# EAGLE board radio_module (EAGLE 8.3.1)
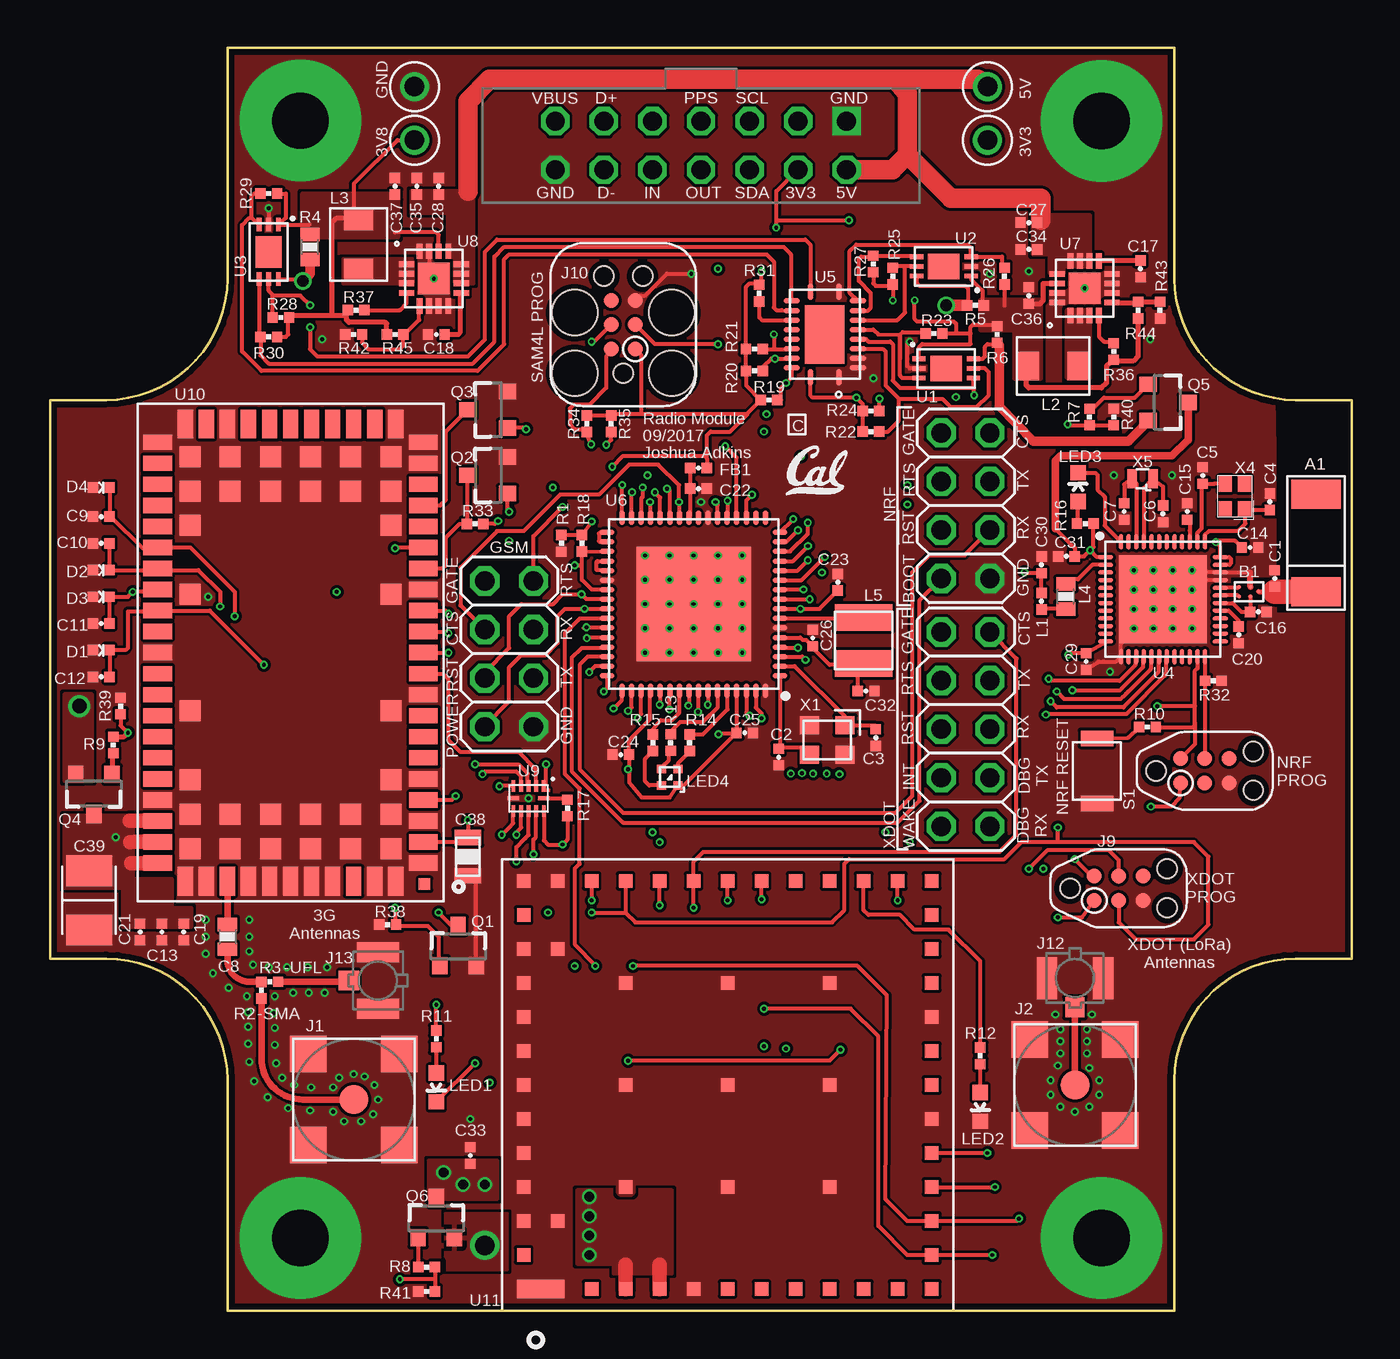
[diagram p6: board, top side]
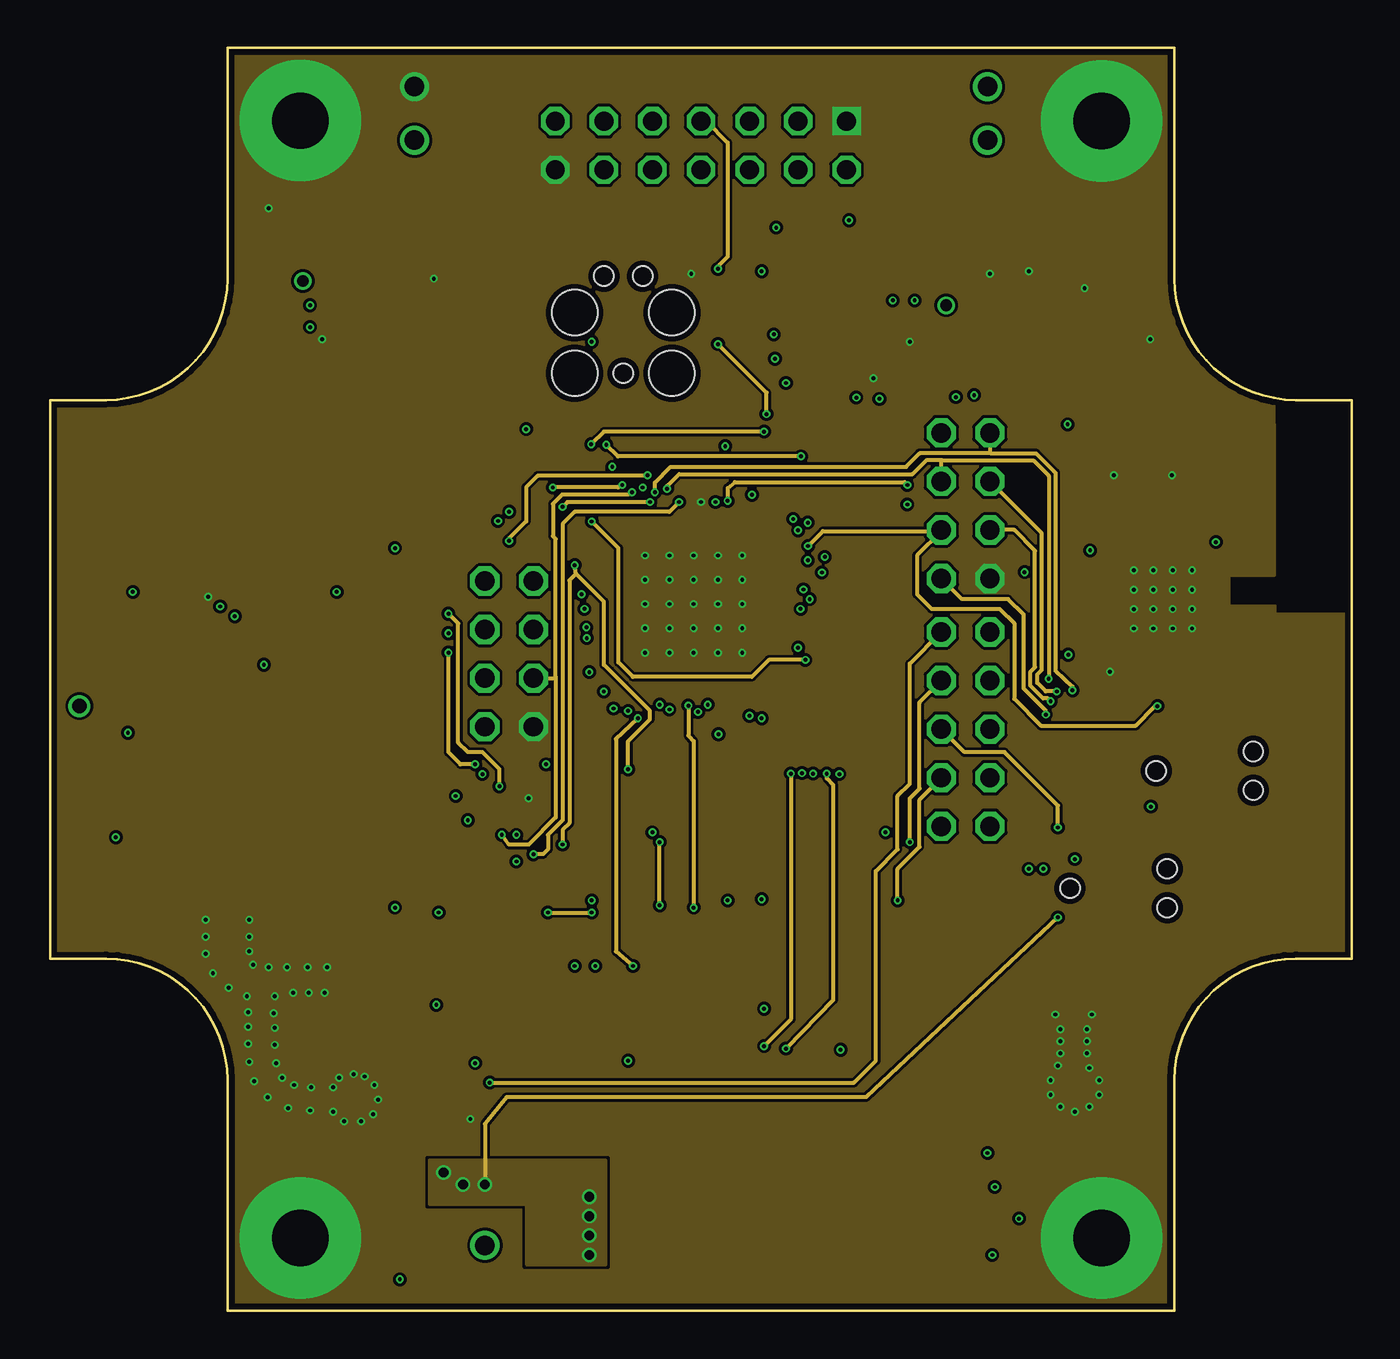
[diagram p7: board, inner layer Route2]
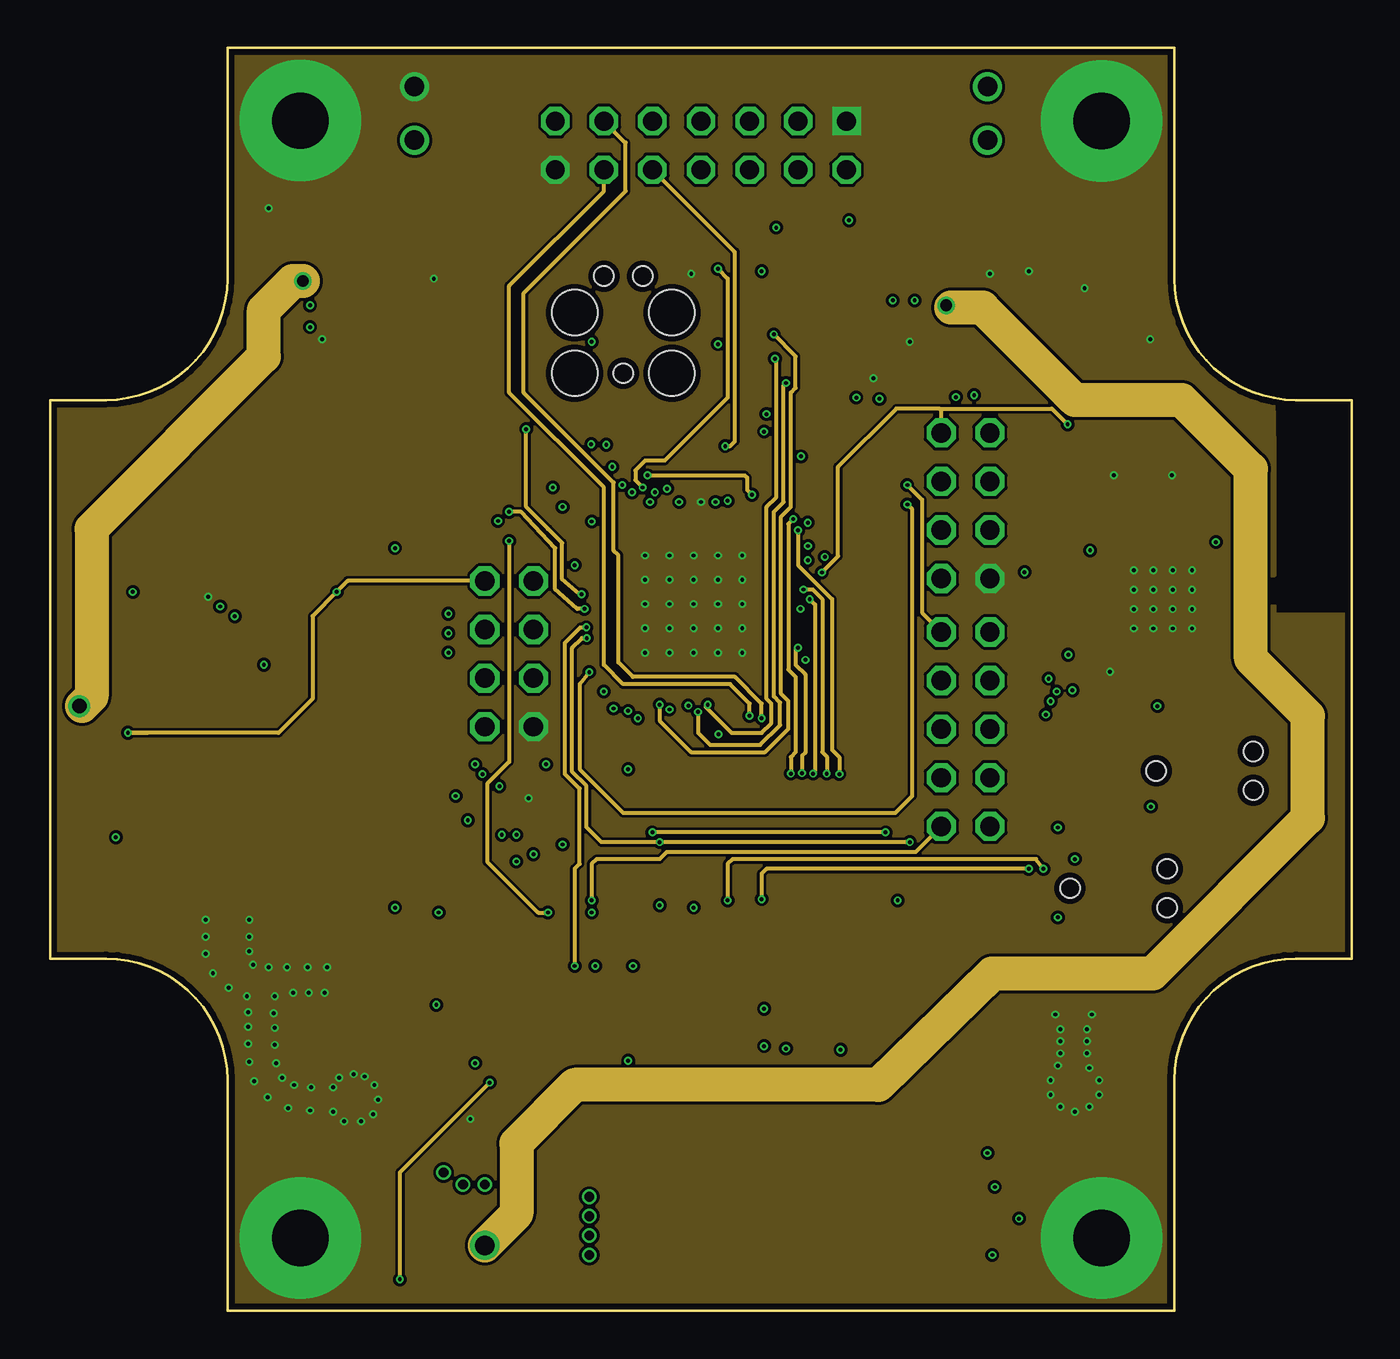
[diagram p8: board, inner layer Route15]
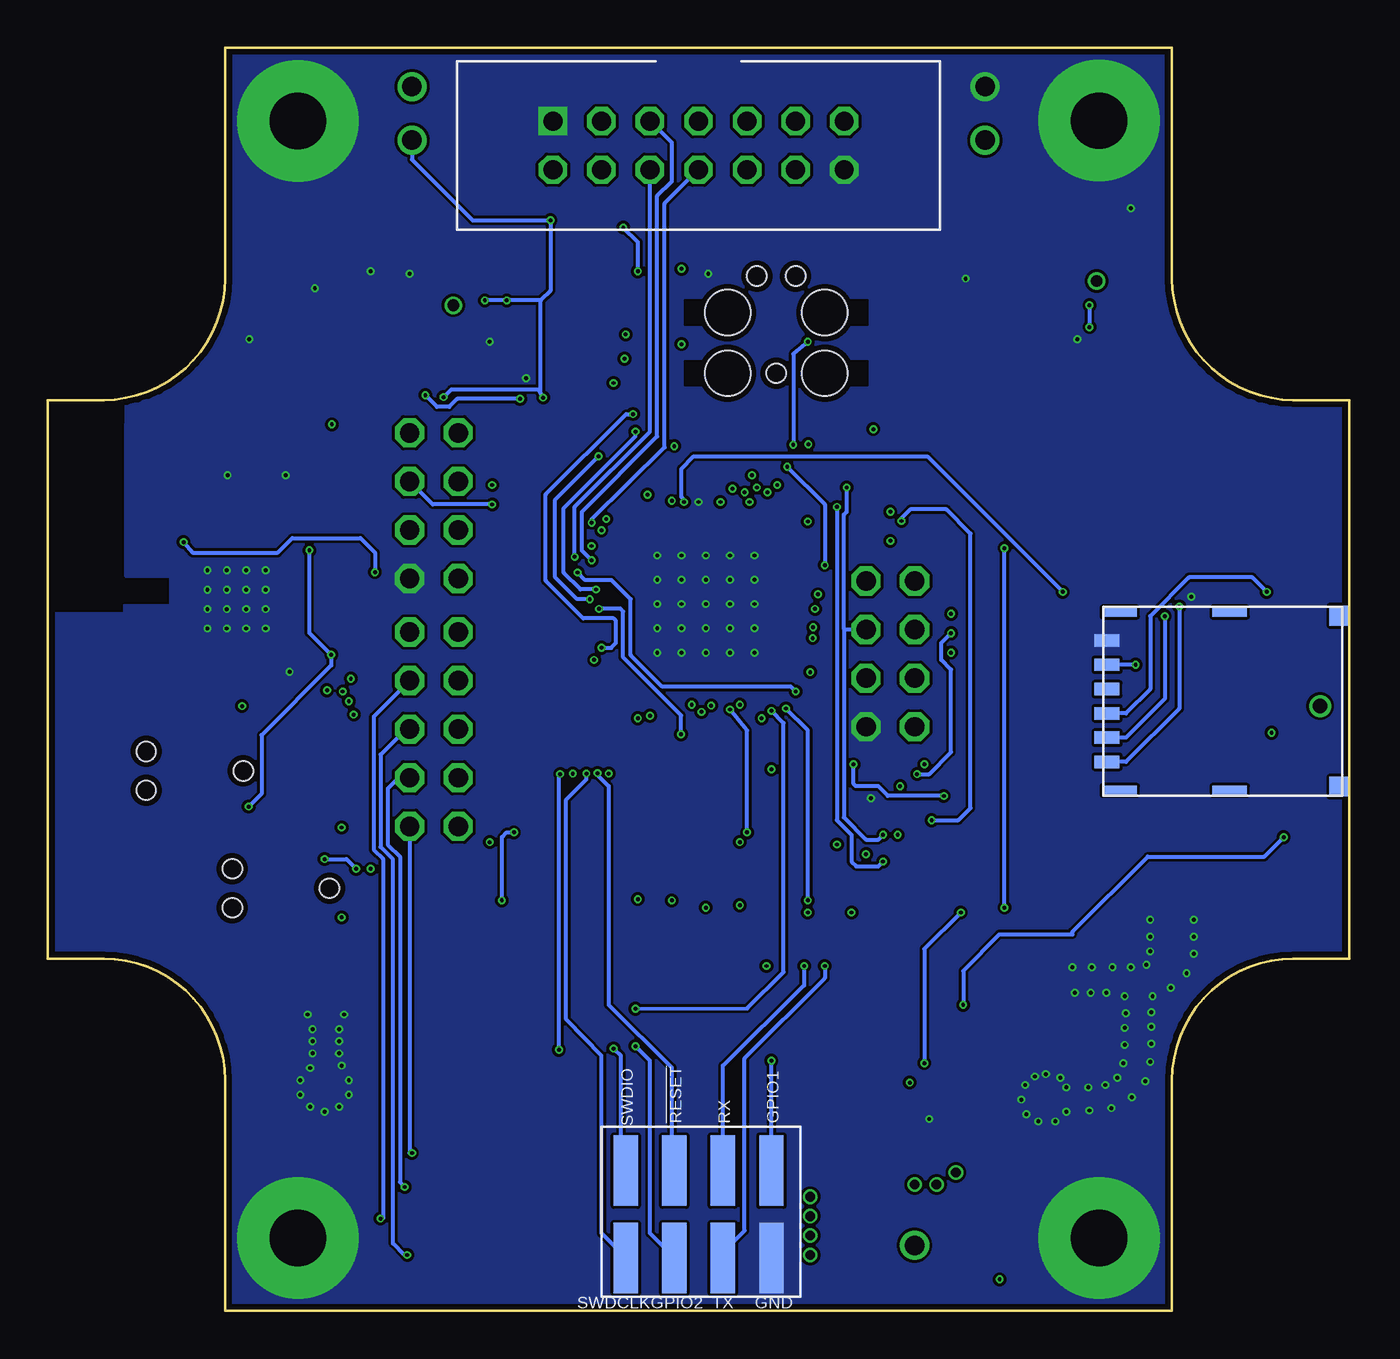
[diagram p9: board, bottom side, seen from below]

Size 68.07 x 66.04 mm. Coordinates in mm from the lower left corner, seen from the top.
Outline: 9.27,12.07 9.27,0 58.8,0 58.8,12.07 arc-90 65.15,18.41 68.07,18.41 68.07,47.62 65.15,47.62 arc-90 58.8,53.98 58.8,66.04 9.27,66.04 9.27,53.98 arc-90 2.92,47.62 0,47.62 0,18.41 2.92,18.41 arc-90 9.27,12.07
Copper layers (1+2*15+16): Top 0.0178mm / dielectric 59mil / Route2 0.0356mm / dielectric 0.1499mm / Route15 0.0356mm / dielectric 0.2007mm / Bottom 0.0178mm
Design rules "quickturn_co_kr_1oz_4lyr *": minimum track width 6mil, minimum drill 8mil, track to track 6mil, track to pad 6mil, pad to pad 6mil, via to via 6mil, smd to smd 6mil, copper to edge 12mil, drill to drill 12mil, minimum pad ring 8mil, minimum via ring 4mil, stop-mask expansion 3mil, vias tented up to drill 50mil, thermal gap 10mil

## Footprints (pad centres in the part's own frame; a part is rotated, then mirrored left to right if it is on the bottom)
FRACTUS-ANTENNA-FR05-S1-N-0-102 = smd 1.5 x 2.6: 1 -2.55,0; 2 2.55,0
BAL-NRF01D3 = smd 0.22 x 0.22: ANT1 -0.517,-0.25; ANT2 -0.517,0.25; GND 0.083,0.25; SE 0.516,0; VCC 0.083,-0.25
0402_CAP = smd 0.536 x 0.546: 1 -0.433,0; 2 0.433,0
0603_CAP = smd 0.7 x 1: 1 -0.65,0; 2 0.65,0
0805_CAP = smd 0.8 x 1.4: P$1 1,0; P$2 -1,0
1210_CAP = smd 2.4 x 1.6: 1 0,1.55; 2 0,-1.55
0402_DIODE = smd 0.536 x 0.546: ANODE -0.433,0; CATHODE 0.433,0
SMA-J/PCB = smd 1.52 x 1.52: 1 0,0 | smd 1.91 x 1.91: 2 -2.375,-2.375; 3 2.375,-2.375; 4 2.375,2.375; 5 -2.375,2.375
WURTH_NANO_SIM = smd 0.65 x 1.3: C1 1.905,6.07; C2 -0.635,6.07; C3 -1.905,6.07; C5 3.175,6.07; C6 0.635,6.07; C7 -3.175,6.07 | smd 1.03 x 1: P$8 -4.465,-6.07; P$9 4.465,-6.07 | smd 0.48 x 1.8: P$10 -4.66,-0.35; P$11 4.66,-0.35; P$12 -4.66,5.4; P$13 4.66,5.4
2X04 = drill 1.016 octagon: 1 -3.81,-1.27; 2 -3.81,1.27; 3 -1.27,-1.27; 4 -1.27,1.27; 5 1.27,-1.27; 6 1.27,1.27; 7 3.81,-1.27; 8 3.81,1.27
2X05 = drill 1.016 octagon: 1 -5.08,-1.27; 2 -5.08,1.27; 3 -2.54,-1.27; 4 -2.54,1.27; 5 0,-1.27; 6 0,1.27; 7 2.54,-1.27; 8 2.54,1.27; 9 5.08,-1.27; 10 5.08,1.27
SIGNPOST_DEBUG_HEADER_SMT = smd 1.27 x 3.683 bottom: 15 -3.835,-2.342; 16 -3.835,2.23; 17 -1.295,-2.342; 18 -1.295,2.23; 19 1.245,-2.342; 20 1.245,2.23; 21 3.785,-2.342; 22 3.785,2.23
SIGNPOST_MODULE_HEADER = drill 0.991 square: 1 7.62,1.27 | drill 0.991 octagon: 2 7.62,-1.27; 3 5.08,1.27; 4 5.08,-1.27; 5 2.54,1.27; 6 2.54,-1.27; 7 0,1.27; 8 0,-1.27; 9 -2.54,1.27; 10 -2.54,-1.27; 11 -5.08,1.27; 12 -5.08,-1.27; 13 -7.62,1.27; 14 -7.62,-1.27
TC2030-IDC-NL = smd 0.787 x 0.787: 1 -1.27,-0.635; 2 -1.27,0.635; 3 0,-0.635; 4 0,0.635; 5 1.27,-0.635; 6 1.27,0.635 | hole 1.016: -2.54,0; 2.54,1.016; 2.54,-1.016
TC2030-IDC = smd 0.787 x 0.787: 1 -1.27,-0.635; 2 -1.27,0.635; 3 0,-0.635; 4 0,0.635; 5 1.27,-0.635; 6 1.27,0.635 | hole 2.375: -2.54,2.54; 0.635,2.54; 0.635,-2.54; -2.54,-2.54 | hole 1.016: -2.54,0; 2.54,1.016; 2.54,-1.016
U.FL_SMT = smd 1.05 x 2.2: GND1 -1.475,0; GND2 1.475,0 | smd 1 x 1.05: SIG 0,-1.525
IHL-1212BZ-11 = smd 1.2 x 1.5: P$1 -1.35,0; P$2 1.35,0
1212 = smd 1.4 x 3: P$1 -1.2,0; P$2 1.2,0
LED-0603 = smd 0.8 x 0.8: A 0,-0.75; C 0,0.75
1MM_SQ_4PAD = smd 0.457 x 0.457: 1 0.432,0.432; 2 0.432,-0.432; 3 -0.432,-0.432; 4 -0.432,0.432
SOT23-3 = smd 0.8 x 0.9: 1 -0.95,-1; 2 0.95,-1; 3 0,1.1
0402_RES = smd 0.536 x 0.546: 1 -0.433,0; 2 0.433,0
0603-RES = smd 0.7 x 1: 1 -0.65,0; 2 0.65,0
B3U-1000P = smd 0.8 x 1.7: 1 -1.7,0; 2 1.7,0
TESTPOINT_0.040IN = drill 1.016: TESTPOINT 0,0
DFN-6-2MMX3MM = smd 0.25 x 0.7: 1 -0.5,-1.425; 2 0,-1.425; 3 0.5,-1.425; 4 0.5,1.425; 5 0,1.425; 6 -0.5,1.425 | smd 1.35 x 1.65: NC 0,0
QFN-48-6MM = smd 0.8 x 0.203: 1 -3,2.2; 2 -3,1.8; 3 -3,1.4; 4 -3,1; 5 -3,0.6; 6 -3,0.2; 7 -3,-0.2; 8 -3,-0.6; 9 -3,-1; 10 -3,-1.4; 11 -3,-1.8; 12 -3,-2.2; 25 3,-2.2; 26 3,-1.8; 27 3,-1.4; 28 3,-1; 29 3,-0.6; 30 3,-0.2; 31 3,0.2; 32 3,0.6; 33 3,1; 34 3,1.4; 35 3,1.8; 36 3,2.2 | smd 0.203 x 0.8: 13 -2.2,-3; 14 -1.8,-3; 15 -1.4,-3; 16 -1,-3; 17 -0.6,-3; 18 -0.2,-3; 19 0.2,-3; 20 0.6,-3; 21 1,-3; 22 1.4,-3; 23 1.8,-3; 24 2.2,-3; 37 2.2,3; 38 1.8,3; 39 1.4,3; 40 1,3; 41 0.6,3; 42 0.2,3; 43 -0.2,3; 44 -0.6,3; 45 -1,3; 46 -1.4,3; 47 -1.8,3; 48 -2.2,3 | smd 4.6 x 4.6: GND 0,0
QFN-N20 = smd 0.85 x 0.28: 1 -2.23,-0.75; 10 2.23,-0.75; 11 2.23,0.75; 20 -2.23,0.75 | smd 0.28 x 0.85: 2 -1.75,-1.73; 3 -1.25,-1.73; 4 -0.75,-1.73; 5 -0.25,-1.73; 6 0.25,-1.73; 7 0.75,-1.73; 8 1.25,-1.73; 9 1.75,-1.73; 12 1.75,1.73; 13 1.25,1.73; 14 0.75,1.73; 15 0.25,1.73; 16 -0.25,1.73; 17 -0.75,1.73; 18 -1.25,1.73; 19 -1.75,1.73 | smd 3.05 x 2.05: P$22 0,0
QFN-64-9MM = smd 0.75 x 0.28: 1 -4.525,3.75; 2 -4.525,3.25; 3 -4.525,2.75; 4 -4.525,2.25; 5 -4.525,1.75; 6 -4.525,1.25; 7 -4.525,0.75; 8 -4.525,0.25; 9 -4.525,-0.25; 10 -4.525,-0.75; 11 -4.525,-1.25; 12 -4.525,-1.75; 13 -4.525,-2.25; 14 -4.525,-2.75; 15 -4.525,-3.25; 16 -4.525,-3.75; 33 4.525,-3.75; 34 4.525,-3.25; 35 4.525,-2.75; 36 4.525,-2.25; 37 4.525,-1.75; 38 4.525,-1.25; 39 4.525,-0.75; 40 4.525,-0.25; 41 4.525,0.25; 42 4.525,0.75; 43 4.525,1.25; 44 4.525,1.75; 45 4.525,2.25; 46 4.525,2.75; 47 4.525,3.25; 48 4.525,3.75 | smd 0.28 x 0.75: 17 -3.75,-4.525; 18 -3.25,-4.525; 19 -2.75,-4.525; 20 -2.25,-4.525; 21 -1.75,-4.525; 22 -1.25,-4.525; 23 -0.75,-4.525; 24 -0.25,-4.525; 25 0.25,-4.525; 26 0.75,-4.525; 27 1.25,-4.525; 28 1.75,-4.525; 29 2.25,-4.525; 30 2.75,-4.525; 31 3.25,-4.525; 32 3.75,-4.525; 49 3.75,4.525; 50 3.25,4.525; 51 2.75,4.525; 52 2.25,4.525; 53 1.75,4.525; 54 1.25,4.525; 55 0.75,4.525; 56 0.25,4.525; 57 -0.25,4.525; 58 -0.75,4.525; 59 -1.25,4.525; 60 -1.75,4.525; 61 -2.25,4.525; 62 -2.75,4.525; 63 -3.25,4.525; 64 -3.75,4.525 | smd 6 x 6: GND 0,0
TQFN-16/3MM = smd 0.3 x 0.8: 1 -0.75,-1.43; 2 -0.25,-1.43; 3 0.25,-1.43; 4 0.75,-1.43; 9 0.75,1.43; 10 0.25,1.43; 11 -0.25,1.43; 12 -0.75,1.43 | smd 0.8 x 0.3: 5 1.43,-0.75; 6 1.43,-0.25; 7 1.43,0.25; 8 1.43,0.75; 13 -1.43,0.75; 14 -1.43,0.25; 15 -1.43,-0.25; 16 -1.43,-0.75 | smd 1.63 x 1.63: GND 0,0
UQFN-12 = smd 0.2 x 0.6: 1 -0.8,-0.65; 2 -0.4,-0.65; 3 0,-0.65; 4 0.4,-0.65; 5 0.8,-0.65; 7 0.8,0.65; 8 0.4,0.65; 9 0,0.65; 10 -0.4,0.65; 11 -0.8,0.65 | smd 0.6 x 0.2: 6 0.8,0; 12 -0.8,0
UBLOX_SARA_G3 = smd 0.8 x 1.5: 1 -11,-6.95; 2 -9.9,-6.95; 3 -8.8,-6.95; 4 -7.7,-6.95; 5 -6.6,-6.95; 6 -5.5,-6.95; 7 -4.4,-6.95; 8 -3.3,-6.95; 9 -2.2,-6.95; 10 -1.1,-6.95; 11 0,-6.95; 12 1.1,-6.95; 13 2.2,-6.95; 14 3.3,-6.95; 15 4.4,-6.95; 16 5.5,-6.95; 17 6.6,-6.95; 18 7.7,-6.95; 19 8.8,-6.95; 20 9.9,-6.95; 21 11,-6.95; 33 11,6.95; 34 9.9,6.95; 35 8.8,6.95; 36 7.7,6.95; 37 6.6,6.95; 38 5.5,6.95; 39 4.4,6.95; 40 3.3,6.95; 41 2.2,6.95; 42 1.1,6.95; 43 0,6.95; 44 -1.1,6.95; 45 -2.2,6.95; 46 -3.3,6.95; 47 -4.4,6.95; 48 -5.5,6.95; 49 -6.6,6.95; 50 -7.7,6.95; 51 -8.8,6.95; 52 -9.9,6.95; 53 -11,6.95 | smd 0.6 x 0.6: 1IND -12.1,-7 | smd 1.5 x 0.8: 22 11.95,-5.5; 23 11.95,-4.4; 24 11.95,-3.3; 25 11.95,-2.2; 26 11.95,-1.1; 27 11.95,0; 28 11.95,1.1; 29 11.95,2.2; 30 11.95,3.3; 31 11.95,4.4; 32 11.95,5.5; 54 -11.95,5.5; 55 -11.95,4.4; 56 -11.95,3.3; 57 -11.95,2.2; 58 -11.95,1.1; 59 -11.95,0; 60 -11.95,-1.1; 61 -11.95,-2.2; 62 -11.95,-3.3; 63 -11.95,-4.4; 64 -11.95,-5.5 | smd 1.1 x 1.1: 65 -10.25,-5.25; 66 -10.25,-3.15; 67 -10.25,-1.05; 68 -10.25,1.05; 69 -10.25,3.15; 70 -10.25,5.25; 71 -8.45,-5.25; 72 -8.45,-3.15; 73 -8.45,-1.05; 74 -8.45,1.05; 75 -8.45,3.15; 76 -8.45,5.25; 77 -6.65,-5.25; 78 -6.65,5.25; 79 -3.05,-5.25; 80 -3.05,5.25; 81 3.05,-5.25; 82 3.05,5.25; 83 6.65,-5.25; 84 6.65,5.25; 85 8.45,-5.25; 86 8.45,-3.15; 87 8.45,-1.05; 88 8.45,1.05; 89 8.45,3.15; 90 8.45,5.25; 91 10.25,-5.25; 92 10.25,-3.15; 93 10.25,-1.05; 94 10.25,1.05; 95 10.25,3.15; 96 10.25,5.25
XDOT_MODULE = smd 0.965 x 2.489: P$1 1.143,21.59 | smd 0.711 x 0.711: P$2 1.143,18.923; P$3 1.143,17.145; P$4 1.143,15.367; P$5 1.143,13.589; P$6 1.143,11.811; P$7 1.143,10.033; P$8 1.143,8.255; P$9 1.143,6.477; P$10 1.143,4.699; P$11 1.143,2.921; P$12 1.143,1.143; P$13 2.921,1.143; P$14 4.699,1.143; P$15 6.477,1.143; P$16 8.255,1.143; P$17 10.033,1.143; P$18 11.811,1.143; P$19 13.589,1.143; P$20 15.367,1.143; P$21 17.145,1.143; P$22 18.923,1.143; P$23 20.701,1.143; P$24 22.479,1.143; P$25 22.479,2.921; P$26 22.479,4.699; P$27 22.479,6.477; P$28 22.479,8.255; P$29 22.479,10.033; P$30 22.479,11.811; P$31 22.479,13.589; P$32 22.479,15.367; P$33 22.479,17.145; P$34 22.479,18.923; P$35 22.479,20.701; P$36 22.479,22.479; P$37 20.701,22.479; P$38 18.923,22.479; P$39 17.145,22.479; P$40 15.367,22.479; P$41 13.589,22.479; P$42 11.811,22.479; P$43 10.033,22.479; P$44 8.255,22.479; P$45 6.477,22.479; P$46 4.699,22.479; P$47 2.921,22.479; P$48 18.923,20.701; P$49 4.699,20.701; P$50 6.477,17.145; P$51 11.811,17.145; P$52 17.145,17.145; P$53 17.145,11.811; P$54 11.811,11.811; P$55 6.477,11.811; P$56 6.477,6.477; P$57 11.811,6.477; P$58 17.145,6.477
FHXXX = smd 1 x 0.95: 1 -0.925,-0.775; 2 0.925,-0.775; 3 0.925,0.775; 4 -0.925,0.775
TXC-8Y = smd 0.8 x 0.7: 1 -0.65,-0.5; 2 0.65,-0.5; 3 0.65,0.5; 4 -0.65,0.5
ABS05 = smd 0.5 x 1: A -0.55,0; B 0.55,0

## Placement (x,y rotation side)
A1  FRACTUS-2.4GHZ-FR05-S1-N-0-102  [FRACTUS-ANTENNA-FR05-S1-N-0-102]  66.2,40.15 90 top
B1  BAL-NRF01D3  [BAL-NRF01D3]  62.7,37.61 0 top
C1  0.8pF  [0402_CAP]  64.05,38.29 90 top
C2  8pF  [0402_CAP]  38.1,28.96 270 top
C3  8pF  [0402_CAP]  43.18,29.97 270 top
C4  12pF  [0402_CAP]  63.79,42.31 90 top
C5  12pF  [0402_CAP]  60.28,43.68 90 top
C6  12pF  [0402_CAP]  58.2,41.67 270 top
C7  12pF  [0402_CAP]  56.17,41.8 270 top
C8  33pF  [0603_CAP]  9.27,19.56 270 top
C9  47pF  [0402_CAP]  2.67,41.53 180 top
C10  47pF  [0402_CAP]  2.67,40.13 180 top
C11  47pF  [0402_CAP]  2.67,35.94 180 top
C12  47pF  [0402_CAP]  2.67,33.15 180 top
C13  56pF  [0402_CAP]  5.84,19.81 270 top
C14  1nF  [0402_CAP]  62.75,39.91 0 top
C15  1nF  [0402_CAP]  59.47,41.8 90 top
C16  2.2nF  [0402_CAP]  63.19,36.55 0 top
C17  3.3nF  [0402_CAP]  57.02,54.48 90 top
C18  3.3nF  [0402_CAP]  20.19,51.05 0 top
C19  10nF  [0402_CAP]  6.98,19.81 270 top
C20  47nF  [0402_CAP]  62.16,35.35 270 top
C21  100nF  [0402_CAP]  4.7,19.81 270 top
C22  100nF  [0402_CAP]  33.91,42.99 0 top
C23  100nF  [0402_CAP]  41.2,38.1 90 top
C24  100nF  [0402_CAP]  29.85,29.08 180 top
C25  100nF  [0402_CAP]  36.32,30.23 0 top
C26  100nF  [0402_CAP]  39.88,35.18 90 top
C27  100nF  [0402_CAP]  51.18,56.9 180 top
C28  100nF  [0402_CAP]  20.32,58.8 90 top
C29  100nF  [0402_CAP]  54.18,33.95 270 top
C30  1uF  [0402_CAP]  51.85,39 90 top
C31  4.7uF  [0402_CAP]  53.15,39.45 180 top
C32  6.8uF  [0402_CAP]  42.67,32.41 0 top
C33  10uF  [0402_CAP]  21.97,8.13 90 top
C34  10uF  [0402_CAP]  51.18,55.5 180 top
C35  10uF  [0402_CAP]  19.18,58.8 90 top
C36  22uF  [0402_CAP]  51.18,53.09 270 top
C37  22uF  [0402_CAP]  18.03,58.8 270 top
C38  100uF  [0805_CAP]  21.84,23.75 90 top
C39  220uF  [1210_CAP]  2.03,21.46 0 top
D1  14V  [0402_DIODE]  2.67,34.54 0 top
D2  14V  [0402_DIODE]  2.67,38.73 0 top
D3  14V  [0402_DIODE]  2.67,37.34 0 top
D4  14V  [0402_DIODE]  2.67,43.05 0 top
FB1  1.5k  [0402_CAP]  33.91,44.07 0 top
J1  MOLEX_73251-135X  [SMA-J/PCB]  15.88,11.05 90 top
J2  MOLEX_73251-135X  [SMA-J/PCB]  53.59,11.81 180 top
J3  NANO_SIM  [WURTH_NANO_SIM]  6.6,31.88 90 bottom
J4  [2X04]  47.88,42.1 270 top
J5  [2X04]  24,34.35 270 top
J6  [2X05]  47.88,30.42 270 top
J7  SIGNPOST_DEBUG_HEADERSMT  [SIGNPOST_DEBUG_HEADER_SMT]  34.06,5.11 0 top
J8  SIGNPOST_MODULE_HEADER  [SIGNPOST_MODULE_HEADER]  34.04,60.93 0 top
J9  TC2030-JLINK-NL  [TC2030-IDC-NL]  55.88,22.1 0 top
J10  TC2030-JLINK-L  [TC2030-IDC]  29.97,51.56 90 top
J11  TC2030-JLINK-NL  [TC2030-IDC-NL]  60.38,28.23 0 top
J12  U.FL-R-SMT  [U.FL_SMT]  53.59,17.4 0 top
J13  U.FL-R-SMT  [U.FL_SMT]  17.14,17.27 270 top
L1  15nH  [0402_CAP]  51.85,37.1 270 top
L2  2.2uH  [IHL-1212BZ-11]  52.45,49.4 180 top
L3  2.2uH  [IHL-1212BZ-11]  16.13,55.75 90 top
L4  10uH  [0603_CAP]  53.12,37.35 90 top
L5  22uH  [1212]  42.55,35.05 90 top
LED1  BLUE  [LED-0603]  20.19,11.68 180 top
LED2  BLUE  [LED-0603]  48.64,10.67 180 top
LED3  BLUE  [LED-0603]  53.76,43.07 0 top
LED4  SML-LX0404SIUPGUSB  [1MM_SQ_4PAD]  32.41,27.91 270 top
Q1  MOSFET-NCHANNELSMD  [SOT23-3]  21.34,19.05 0 top
Q2  MOSFET-NCHANNELSMD  [SOT23-3]  22.92,43.69 90 top
Q3  MOSFET-NCHANNELSMD  [SOT23-3]  22.92,47.12 90 top
Q4  SI223DDS  [SOT23-3]  2.29,27.05 180 top
Q5  SI223DDS  [SOT23-3]  58.42,47.5 270 top
Q6  SI223DDS  [SOT23-3]  20.19,4.83 0 top
R1  0  [0402_RES]  26.74,40.13 90 top
R2  0  [0402_RES]  11.05,16.76 270 top
R3  0  [0402_RES]  11.49,17.21 0 top
R4  0.015  [0603-RES]  13.59,55.63 90 top
R5  0.43  [0402_RES]  48.39,52.58 0 top
R6  3.32  [0402_RES]  49.53,51.05 90 top
R7  100  [0402_RES]  54.36,46.74 270 top
R8  100  [0402_RES]  19.68,2.29 0 top
R9  100  [0402_RES]  3.3,29.59 90 top
R10  150  [0402_RES]  57.39,30.53 180 top
R11  1k  [0402_RES]  20.19,14.22 90 top
R12  1k  [0402_RES]  48.64,13.34 90 top
R13  1k  [0402_RES]  32.45,29.71 270 top
R14  1k  [0402_RES]  33.44,29.71 270 top
R15  1k  [0402_RES]  31.52,29.71 270 top
R16  1k  [0402_RES]  54.14,41.16 180 top
R17  10k  [0402_RES]  27.05,26.29 270 top
R18  10k  [0402_RES]  27.81,40.13 270 top
R19  10k  [0402_RES]  37.59,47.62 0 top
R20  10k  [0402_RES]  36.83,49.15 0 top
R21  10k  [0402_RES]  36.83,50.29 0 top
R22  10k  [0402_RES]  42.93,45.97 180 top
R23  10k  [0402_RES]  46.23,51.1 0 top
R24  10k  [0402_RES]  42.93,47.05 180 top
R25  10k  [0402_RES]  44.07,54.1 270 top
R26  10k  [0402_RES]  49.91,54.1 270 top
R27  10k  [0402_RES]  43.05,54.74 270 top
R28  10k  [0402_RES]  12.06,51.94 0 top
R29  10k  [0402_RES]  11.43,58.42 0 top
R30  10k  [0402_RES]  11.43,50.93 0 top
R31  10k  [0402_RES]  37.08,53.21 270 top
R32  12k  [0402_RES]  60.83,32.95 0 top
R33  100k  [0402_RES]  22.22,41.15 0 top
R34  100k  [0402_RES]  28.07,46.38 90 top
R35  100k  [0402_RES]  29.34,46.38 90 top
R36  100k  [0402_RES]  55.63,50.16 270 top
R37  100k  [0402_RES]  16,52.32 180 top
R38  100k  [0402_RES]  17.65,20.19 0 top
R39  100k  [0402_RES]  3.68,31.62 270 top
R40  100k  [0402_RES]  55.63,46.74 270 top
R41  100k  [0402_RES]  19.68,1.02 0 top
R42  200k  [0402_RES]  15.88,51.05 0 top
R43  240k  [0402_RES]  58.04,52.32 90 top
R44  750k  [0402_RES]  56.9,52.32 270 top
R45  750k  [0402_RES]  18.03,51.05 180 top
S1  B3U-1000P  [B3U-1000P]  54.75,28.23 90 top
TP1  TEST_POINT_0.040IN  [TESTPOINT_0.040IN]  49.02,61.21 0 top
TP2  TEST_POINT_0.040IN  [TESTPOINT_0.040IN]  19.05,61.21 0 top
TP3  TEST_POINT_0.040IN  [TESTPOINT_0.040IN]  19.05,64.01 0 top
TP4  TEST_POINT_0.040IN  [TESTPOINT_0.040IN]  49.02,64.01 0 top
U1  LTC2941  [DFN-6-2MMX3MM]  46.86,49.28 270 top
U2  LTC2941  [DFN-6-2MMX3MM]  46.74,54.61 90 top
U3  LTC2941  [DFN-6-2MMX3MM]  11.43,55.37 180 top
U4  NRF51822QF  [QFN-48-6MM]  58.2,37.21 0 top
U5  PCA9544AQFN-N20  [QFN-N20]  40.51,51.05 90 top
U6  SAM4LC8BA  [QFN-64-9MM]  33.66,36.96 180 top
U7  TLV62130  [TQFN-16/3MM]  54.1,53.47 0 top
U8  TLV62130  [TQFN-16/3MM]  20.07,53.98 270 top
U9  TXB0104RUT  [UQFN-12]  25.02,26.8 180 top
U10  UBLOX_SARA_G350  [UBLOX_SARA_G3]  12.57,34.42 90 top
U11  XDOT_MODULE  [XDOT_MODULE]  47.24,0 90 top
U$1  UCB_CAL100MIL  [UCB_CAL_100MIL]  38.48,42.67 0 top
X1  16 MHz  [FHXXX]  40.64,29.84 180 top
X4  16MHz  [TXC-8Y]  61.96,42.59 90 top
X5  ABS05-32.768KHZ-9-T  [ABS05]  57.13,43.5 180 top

## Tracks (layer width: path | path; a pad name or v marks a point on that pad's centre or on a via)
3V3  (via drill 0.2)
  Top 0.152: 48.77,52.45 R5.2 | 49.46,51.56 R6.2
  Top 0.203: U9.11 25.82,24.6 26.04,24.38 v26.8,24.38 27.05,24.64 R17.2 | v27.43,38.99 27.81,38.99 | 27.81,38.99 27.81,38.23 28.33,37.71 U6.39 | 27.81,38.99 R18.2 | R18.2 28.02,39.75 | R18.2 29.1,39.68 U6.35 | R34.2 R35.2 29.36,46.84 29.44,46.91 30.92,46.91 | v29.4,44.13 29.97,44.7 34.22,44.7 34.34,44.58 | 30.28,28.37 v30.23,28.32 | 30.28,28.37 30.28,27.63 30.94,26.85 32.42,26.85 LED4.1 33.14,27.47 35.86,30.2 | 30.28,28.37 C24.1 30.28,29.83 31.37,30.93 31.37,32.4 U6.52 | 30.92,46.91 30.92,49.97 J10.1 | 30.92,46.91 36.45,46.91 | 34.34,44.02 FB1.2 34.34,44.58 | 34.34,44.58 34.34,45.77 34.54,45.97 35.56,45.97 36.45,46.86 36.45,46.91 | v34.95,30.15 34.95,30.18 34.98,30.2 35.86,30.2 | 35.86,30.2 C25.1 | 35.89,30.1 C25.1 | C25.1 35.91,30.24 U6.61 | 36.45,46.91 R19.1 36.4,48.39 R20.1 R21.1 36.4,53.54 36.58,53.72 37.14,53.72 R31.1 37.21,53.72 v37.21,54.36 | v37.97,56.64 37.97,57.02 | 37.97,57.02 37.97,58.55 39.09,59.66 J8.4 | 37.97,57.02 v41.78,57.02 | U6.8 v39.24,36.71 | v39.24,36.71 v39.24,36.7 | v39.24,36.71 40.24,36.71 C23.1 41.15,37.64 | 39.75,48.9 U5.20 39.75,48.56 39.75,47.88 39.88,47.75 v42.16,47.75 42.49,47.42 R24.2 R22.2 | R27.2 43.05,53.72 43.18,53.59 43.99,53.59 R25.2 v44.07,52.83 | v45.21,52.83 45.21,51.87 45.34,51.74 47.24,51.74 47.37,51.61 47.37,51.11 | U1.1 45.44,50.39 45.59,50.55 48.13,50.55 48.13,51.11 | R23.2 47.37,51.11 | 47.37,51.11 48.13,51.11 | 48.13,51.11 48.13,51.44 48.26,51.56 49.46,51.56 | U2.1 48.16,53.95 48.77,53.34 48.77,52.45 | R26.2 49.91,52.58
  Top 0.254: L2.P$2 51.05,49.86 51.05,48.39 51.18,48.26 54.99,48.26 55.25,48.51 55.25,49.4 R36.2 55.7,49.66 56.64,49.66 56.9,49.91 R44.2 | C36.2 51.76,52.65 51.94,52.83 51.94,53.72 U7.14
  Route2 0.203: v26.8,24.38 26.8,25.15 27.15,25.51 27.15,38.2 27.5,38.54 | 27.5,38.54 v27.43,38.99 | 27.5,38.54 28.96,37.08 28.96,33.78 31.37,31.37 31.37,30.93 30.23,29.78 v30.23,28.32
  Bottom 0.203: v27.43,38.99 27.43,42.16 v29.4,44.13 | v34.95,30.15 34.95,31.14 37.97,34.16 37.97,36.58 38.1,36.7 v39.24,36.7 | v37.21,54.36 37.21,55.88 v37.97,56.64 | 42.29,52.83 41.78,53.34 v41.78,57.02 45.85,57.02 49.02,60.2 TP1.TESTPOINT | v42.16,47.75 42.29,47.95 | 42.29,47.95 42.29,52.83 | 42.29,52.83 v44.07,52.83 v45.21,52.83 | 42.29,47.95 42.47,48.18 46.97,48.18 v47.37,47.78
  pour Top (no thermals): 51.82,48.77 51.82,52.83 48.64,52.83 48.64,51.31 50.42,51.31 50.42,48.77
3V8
  Top 0.152: 11.99,56.86 U3.1 | 12.45,51.89 R28.2
  Top 0.203: R30.2 12.32,50.93 12.45,51.05 12.45,51.89 | R29.2 12.32,58.42 12.32,57.15 11.99,56.86 | U3.1 13.56,56.8 | R28.2 12.57,52.07 | L3.P$2 15.88,57.36 15.88,58.93 18.16,61.21 TP2.TESTPOINT | 18.03,56.39 20.19,56.39 20.32,56.27 U8.14
  Top 0.254: 12.57,52.07 14.73,52.07 | 14.73,52.07 14.73,56.9 14.99,57.15 15.57,57.15 L3.P$2 | 14.73,52.07 15.37,52.07 15.44,52.15 R37.2 15.49,52.15 15.49,51.82 15.62,51.69 17.53,51.69 17.6,51.61 R45.2
  pour Top (no thermals): 13.21,58.42 18.16,58.42 18.16,56.13 13.21,56.13
3V8SWOUT
  pour Top (no thermals): 15.37,54.99 18.92,54.99 18.92,53.72 15.37,53.72
3VSWOUT
  pour Top (no thermals): 53.21,48.77 53.21,52.32 54.36,52.32 54.36,48.77
5V
  Top 0.254: U7.10
  Top 1.016: 21.84,58.55 21.84,63.25 22.99,64.39 44.2,64.39 | J8.2 44.04,59.66 44.83,60.45 | 44.2,64.39 44.83,63.63 44.83,60.45 | 44.83,60.45 47.12,58.17 51.82,58.17 51.82,57.02 | 44.2,64.39 48.51,64.39 TP4.TESTPOINT
  pour Top (no thermals): 54.36,54.61 52.96,54.61 52.96,54.23 52.32,54.23 52.32,55.24 51.44,55.24 51.44,57.28 54.36,57.28
  pour Top (no thermals): 20.83,55.12 20.83,57.4 18.92,57.4 18.92,58.55 22.1,58.55 22.1,53.72 21.21,53.72 21.21,55.12
!RADIO_RESET  (via drill 0.2)
  Top 0.203: J10.3 31.62,50.55 v34.93,50.55 | U6.4 38.22,34.67 v39.12,34.67
  Route2 0.203: v37.47,46.89 37.47,48.01 v34.93,50.55
  Route15 0.203: v39.12,34.67 38.99,34.54 38.99,33.78 39.5,33.27 39.5,29.19 39.32,29.03 v39.32,28.12
  Bottom 0.203: J7.20 35.31,7.37 35.43,7.49 35.43,12.7 38.74,16 38.74,27.43 39.32,28.02 v39.32,28.12 | v37.47,46.89 37.82,46.89 37.85,46.86 42.04,42.7 42.04,38.18 40.07,36.21 38.48,36.21 38.35,36.08 38.35,34.93 38.61,34.67 v39.12,34.67
!XDOT_RESET  (via drill 0.2)
  Top 0.203: v28.32,20.83 30.1,20.83 | 30.1,20.83 30.61,20.32 40.89,20.32 41.53,20.96 41.53,23.37 41.78,23.62 49.91,23.62 50.8,24.51 52.71,24.51 | U11.P$33 30.1,20.83 | U6.19 36.41,42.37 v36.7,42.67 | 52.71,24.51 v52.71,25.27 | J9.3 55.88,20.32 56.77,19.43 59.82,19.43 60.58,20.19 60.58,23.75 59.82,24.51 52.71,24.51
  Route2 0.203: v24,40.26 24,40.39 24.89,41.27 24.89,43.05 25.5,43.66 31.22,43.66 v31.24,43.69 | v26.04,20.83 v28.32,20.83 | J6.5 47.82,29.21 49.91,29.21 52.71,26.42 v52.71,25.27
  Route15 0.203: v24,40.26 24,28.7 22.86,27.56 22.86,23.5 25.53,20.83 v26.04,20.83 | v31.24,43.69 36.32,43.69 36.45,43.56 36.45,42.93 v36.7,42.67
AVDD1  (via drill 0.2)
  Top 0.203: v50.96,38.62 51.01,38.57 C30.1 L1.1 | U4.35 61.68,39.01 61.76,39.11 61.76,39.31 61.66,39.41 U4.36 61.2,39.97 v60.97,40.2 61.02,40.26 61.97,40.26 C14.1
  Bottom 0.203: v50.96,38.62 50.96,39.64 51.72,40.4 55.28,40.4 56.04,39.64 60.49,39.64 v60.97,40.2
CONTROLLER_BUCK/LDO_N  (via drill 0.2)
  Top 0.203: R1.2 26.87,40.56 R18.1 v28.32,41.27 | U6.3 39.33,34.21 v39.5,34.04
  Route2 0.203: v28.32,41.27 29.72,39.88 29.72,33.91 30.48,33.15 36.7,33.15 37.59,34.04 v39.5,34.04
DBG_GPIO1  (via drill 0.2)
  Top 0.203: U6.15 38.51,40.21 v39.12,40.82 | v30.23,13.08 40.77,13.08 v41.34,13.65
  Route15 0.203: v39.12,40.82 39.12,38.99 40.89,37.21 40.89,29.34 41.28,28.96 v41.28,28.07
  Bottom 0.203: J7.16 v30.23,13.08 | v41.34,13.65 41.34,28 v41.28,28.07
DBG_GPIO2  (via drill 0.2)
  Top 0.203: U6.16 v38.86,41.4
  Route2 0.203: v37.34,13.84 38.74,15.24 v38.74,28.09
  Route15 0.203: v38.74,28.09 38.74,28.96 38.99,29.21 38.99,33.15 38.61,33.53 38.61,41.15 v38.86,41.4
  Bottom 0.203: J7.19 35.31,2.79 36.58,4.06 36.58,13.08 v37.34,13.84
DCC1
  Top 0.203: L4.2 53.18,38.24 53.76,38.24 54.52,39.01 U4.2
DEBUG_RX  (via drill 0.2)
  Top 0.203: v28.51,18.03 27.43,19.18 27.43,23.11 27.69,23.37 27.69,27.3 26.92,28.07 26.92,35.43 27.69,36.2 29.12,36.2 U6.42
  Bottom 0.203: v28.51,18.03 28.51,17.02 32.77,12.83 J7.18
DEBUG_TX  (via drill 0.2)
  Top 0.203: v28.04,35.74 27.92,35.71 U6.43
  Route15 0.203: v27.43,18.03 27.43,23.11 27.69,23.37 27.69,27.3 26.92,28.07 26.92,34.93 27.74,35.74 v28.04,35.74
  Bottom 0.203: v27.43,18.03 27.43,17.4 31.62,13.21 31.62,4.19 32.77,3.05 J7.17
GND  (via drill 0.2, 2.95 pad 6.35)
  Top 0.203: v11.43,57.66 U3.2 | U10.14 | U8.GND 19.82,54.23 U8.15 | Q1.2 22.29,22.43 C38.P$2 | J10.5 30.86,53.09 31.11,53.09 32.26,54.23 v33.53,54.23 | v44.96,50.67 44.83,50.55 44.83,49.4 44.96,49.28 U1.2 | C29.2 54.85,33.95 55.1,33.95 55.74,33.95 U4.13 56,34.87 v56.68,35.68 | v56.68,37.71 v56.68,38.73 | v57.69,37.71 U4.GND | U4.33 60.37,38.21 v59.72,38.73 59.97,38.61 U4.34 62.76,38.61 62.77,38.61
  Top 0.254: 53.85,53.22 U7.GND 54.35,53.22
  Top 0.305: B1.GND 62.77,38.61
  other vias: 8.13,18.67 8.13,19.56 8.13,20.45 8.25,37.34 8.51,17.65 9.33,16.89 10.29,16.45 10.35,13.97 10.35,14.86 10.35,15.62 10.41,13.02 10.41,18.8 10.41,19.56 10.41,20.45 10.6,18.1 10.67,12 11.37,11.18 11.43,17.97 11.68,15.56 11.75,13.91 11.75,14.8 11.75,16.45 11.81,12.95 12.13,12.19 12.38,17.97 12.45,10.6 12.7,16.64 12.76,11.81 13.08,3.81 13.08,62.23 13.46,17.97 13.53,16.64 13.59,10.48 13.65,11.68 14.22,50.8 14.35,16.64 14.48,17.97 14.8,10.41 14.8,11.68 15.11,12.19 15.37,9.91 15.88,12.38 16.26,9.91 16.45,12.26 16.89,10.29 16.95,11.81 17.14,11.05 20.07,53.98 21.97,10.03 25.02,26.8 31.11,34.42 31.11,35.69 31.11,36.96 31.11,38.23 31.11,39.5 32.39,34.42 32.39,35.69 32.39,36.96 32.39,38.23 32.39,39.5 33.66,34.42 33.66,35.69 33.66,36.96 33.66,38.23 33.66,39.5 34.04,42.29 34.93,34.42 34.93,35.69 34.93,36.96 34.93,38.23 34.93,39.5 36.2,34.42 36.2,35.69 36.2,36.96 36.2,38.23 36.2,39.5 43.05,48.77 49.15,54.23 51.18,54.36 52.32,11.3 52.32,12.07 52.58,15.49 52.71,12.83 52.83,10.67 52.83,13.46 52.83,14.1 52.83,14.73 53.59,10.41 54.1,53.47 54.23,13.46 54.23,14.1 54.23,14.73 54.36,10.67 54.36,12.7 54.48,15.49 54.86,11.3 54.86,12.07 54.99,3.81 54.99,62.2 55.43,33.42 55.63,43.69 56.68,36.69 57.53,50.8 57.69,35.68 57.69,36.69 57.69,38.73 58.67,43.69 58.71,35.68 58.71,36.69 58.71,37.71 58.71,38.73 59.72,35.68 59.72,36.69 59.72,37.71
  pour Bottom (no thermals): 9.27,0 9.27,12.19 arc90 3.05,18.41 0,18.41 0,47.62 2.79,47.62 arc90 9.27,54.1 9.27,66.04 58.8,66.04 58.8,53.98 arc90 64.01,47.75 64.02,45.05 64.02,38.41 61.67,38.41 61.67,36.88 64.08,36.88 64.08,36.45 68.03,36.45 68.07,18.41 65.15,18.41 arc90 58.8,12.07 58.8,0
  pour Route15 (no thermals): 9.27,0 9.27,12.19 arc90 3.05,18.41 0,18.41 0,47.62 2.79,47.62 arc90 9.27,54.1 9.27,66.04 58.8,66.04 58.8,53.98 arc90 64.01,47.75 64.04,45.07 64.04,38.41 61.66,38.41 61.66,36.88 64.06,36.88 64.06,36.45 68.03,36.45 68.07,18.41 65.15,18.41 arc90 58.8,12.07 58.8,0
  pour Route2 (rank 2, no thermals): 9.27,0 9.27,12.19 arc90 3.05,18.41 0,18.41 0,47.62 2.79,47.62 arc90 9.27,54.1 9.27,66.04 58.8,66.04 58.8,53.98 arc90 64.01,47.75 64.02,45.07 64.02,38.44 61.66,38.44 61.66,36.88 64.06,36.88 64.06,36.45 68.01,36.45 68.07,18.41 65.15,18.41 arc90 58.8,12.07 58.8,0
  pour Top (rank 2, no thermals): 58.8,66.04 58.8,54.23 arc90 64.01,47.75 64.04,45.05 64.04,38.41 61.67,38.41 61.67,36.86 64.08,36.86 64.08,36.45 68.05,36.45 68.07,18.41 65.28,18.41 arc90 58.8,11.81 58.8,0 9.27,0 9.27,11.68 arc90 3.43,18.41 0,18.41 0,47.62 3.05,47.62 arc90 9.14,53.72 9.27,53.72 9.27,66.04
GSM_3V8  (via drill 0.61, 0.76)
  Top 0.152: 13.18,53.95 v13.21,53.85
  Top 0.203: U3.6 13.31,53.95 13.59,54.23
  Top 0.508: v13.21,53.85 13.59,54.23 R4.1
  Route15 0.203: 1.65,31.62 v1.52,31.62
  Route15 1.778: v13.21,53.85 12.7,53.85 11.18,52.32 11.18,49.91 2.16,40.89 2.16,32.13 1.65,31.62
  pour Top (no thermals): 0.76,27.69 0.76,32.26 2.16,32.26 2.16,27.69
GSM_CTS  (via drill 0.2)
  Top 0.203: J5.3 21.46,36.89 21.46,38.86 23.37,40.77 24.77,40.77 26.67,42.67 28.7,42.67 30.28,44.25 31.8,44.25 32.89,43.18 v32.89,42.29 v32.91,42.28 U6.26 32.89,41.49 | v25.27,23.88 25.27,24.64 25.4,24.77 25.4,26.13 U9.10
  Route2 0.203: v25.27,23.88 25.78,23.88 26.04,24.13 26.04,24.89 26.8,25.65 26.8,41.15 27.43,41.78 32.39,41.78 v32.89,42.29
GSM_GATED  (via drill 0.2)
  Top 0.203: R11.2 v20.19,16
  Top 0.762: 4.19,24.51 4.45,24.52 U10.52 | U10.53 4.24,23.42 | U10.51 4.15,25.62
  Bottom 0.203: v20.19,16 20.19,17.78 18.29,19.69 14.48,19.69 14.48,19.81 10.54,23.75 4.45,23.75 v3.43,24.77
  pour Top (no thermals): 7.37,20.07 3.81,20.07 3.81,22.1 0.76,22.1 0.76,25.91 4.32,25.91 4.32,22.61 6.35,22.61 6.35,21.08 7.37,21.08
GSM_GAUGE_ALERT  (via drill 0.2)
  Top 0.203: U3.5 11.43,53.34 11.63,53.14 | R28.1 11.63,53.14 | 11.63,53.14 11.71,53.09 13.08,53.09 v13.59,52.58 | v13.59,51.44 13.59,50.29 13.97,49.91 21.84,49.91 22.73,50.8 22.73,55.37 23.37,56.01 39.5,56.01 39.75,55.75 39.75,53.3 U5.11
  Bottom 0.203: v13.59,52.58 v13.59,51.44
GSM_GAUGE_SCL
  Top 0.152: 10.67,58.42 R29.1 | U3.3 10.89,56.8
  Top 0.203: 10.54,57.15 10.41,57.15 10.03,56.77 10.03,50.16 11.05,49.15 22.35,49.15 23.75,50.55 23.75,54.99 24,55.24 37.47,55.24 37.85,54.86 37.85,52.45 37.97,52.32 38.26,52.32 U5.13 | 10.54,57.15 10.54,58.29 10.67,58.42 | 10.89,56.8 10.54,57.15
GSM_GAUGE_SDA
  Top 0.152: 10.92,50.93 10.93,50.87 R30.1 | U3.4 10.93,53.98 10.92,53.85
  Top 0.203: 10.92,53.85 10.92,50.93 | R30.1 11,49.96 11.43,49.53 22.1,49.53 23.24,50.67 23.24,55.12 23.75,55.63 38.35,55.63 38.74,55.24 38.74,53.01 U5.12 38.76,52.96
GSM_LED  (via drill 0.2)
  Top 0.203: v18.03,21.08 18.03,20.25 R38.2 18.16,20.12 19.76,20.12 20.32,19.56 20.32,18.12 Q1.1 | v18.03,39.88 18.07,39.92 U10.16
  Bottom 0.203: v18.03,21.08 v18.03,39.88
GSM_POWER  (via drill 0.2)
  Top 0.203: J5.7 22.73,30.61 24,31.88 24,33.66 24.64,34.29 25.91,34.29 26.54,34.93 26.54,36.32 26.92,36.7 v27.94,36.7 U6.41 | Q2.1 23.92,41.86 v24,41.78
  Route15 0.203: v24,41.78 24.64,41.78 26.42,39.88 26.42,37.72 27.56,36.7 v27.94,36.7
GSM_POWER_GATE  (via drill 0.2)
  Top 0.203: U6.22 34.91,42.14 v34.8,42.29 | R39.2 3.68,30.61 v4.06,30.23
  Top 0.254: R9.2 3.86,30.02 v4.06,30.23
  Route15 0.203: J5.1 15.56,38.16 v14.99,37.59 13.72,36.32 13.72,32 11.94,30.23 v4.06,30.23 5.08,30.23
  Bottom 0.203: v14.99,37.59 22.07,44.68 34.29,44.68 34.93,44.04 34.93,42.55 34.8,42.42 v34.8,42.29
GSM_RST  (via drill 0.2)
  Top 0.203: J5.5 22.73,33.4 24,34.67 24,36.32 24.64,36.96 26.29,36.96 26.8,37.47 v27.79,37.47 28.04,37.21 U6.40 | Q3.1 24.83,46.17 v24.89,46.1
  Route15 0.203: v24.89,46.1 24.89,42.04 26.04,40.89 26.77,40.15 26.77,38.25 27.69,37.47 v27.79,37.47
GSM_RTS  (via drill 0.2)
  Top 0.203: v24.38,23.5 24.38,24.25 24.84,24.7 24.84,24.71 25.02,24.89 U9.9 | J5.2 25.27,40.51 v26.8,42.04 | U6.29 31.4,42.26 v31.37,42.29
  Route2 0.203: v26.8,42.04 27.05,42.29 v31.37,42.29
  Bottom 0.203: v24.38,23.5 24.64,23.24 25.78,23.24 26.04,23.5 26.04,24.89 26.8,25.65 v26.8,42.04
GSM_RX  (via drill 0.2)
  Top 0.203: v24.38,24.89 24.38,25.02 24.64,25.27 24.64,26.13 U9.8 | U6.32 29.9,42.99 v29.92,43.18
  Route2 0.203: v26.29,43.05 29.72,43.05 29.85,43.18 v29.92,43.18
  Bottom 0.203: v24.38,24.89 24.64,24.64 25.27,24.64 26.44,25.81 26.44,35.69 | J5.4 26.38,35.62 26.44,35.69 | v26.29,43.05 26.29,41.78 26.44,41.63 26.44,35.69
GSM_TX  (via drill 0.2)
  Top 0.203: v23.62,24.89 24.05,25.32 24.18,25.46 24.22,25.5 U9.7 | U6.31 30.4,42.72 v30.43,42.8
  Route2 0.203: v23.62,24.89 24,24.38 25.02,24.38 26.44,25.81 26.44,33.15 | J5.6 26.38,33.08 26.44,33.15 | 26.44,33.15 26.44,40.36 26.29,40.51 26.29,42.19 26.77,42.67 30.23,42.67 30.35,42.8 v30.43,42.8
IM880_GAUGE_ALERT
  Top 0.203: U5.7 44.31,51.8 44.7,52.2 44.7,54.61 | R25.1 44.14,54.61 44.7,54.61 | U2.5 44.7,54.61
IM880_GAUGE_SCL
  Top 0.203: U5.9 41.78,53.26 41.78,55.37 42.16,55.75 48.01,55.75 48.13,55.63 48.13,55.14 U2.3 49.78,55.12 49.78,54.74 R26.1
IM880_GAUGE_SDA
  Top 0.152: 45.24,55.17 U2.4
  Top 0.203: U5.8 42.78,52.3 42.93,52.45 42.93,53.21 42.29,53.85 42.29,54.99 42.42,55.12 43.26,55.12 R27.1 45.24,55.17
MOD_IN  (via drill 0.2)
  Top 0.203: U6.20 35.91,44.61 v35.31,45.21
  Route15 0.203: v35.31,45.21 35.56,45.21 35.81,45.47 35.81,55.37 35.79,55.37 J8.10
MOD_OUT  (via drill 0.2)
  Top 0.203: U6.14 38.7,39.71 39.62,40.63 v39.62,41.21
  Bottom 0.203: J8.8 34.06,59.66 35.81,57.91 35.81,45.15 39.62,41.4 v39.62,41.21
N$1  (via drill 0.2)
  Top 0.203: v11.18,33.78 8.34,36.62 U10.41 5.58,36.58 4.06,36.58 4.06,34.67 3.94,34.54 D1.CATHODE C12.1
  Bottom 0.203: v11.18,33.78 J3.C1
N$2  (via drill 0.2)
  Top 0.203: C11.1 D3.CATHODE 4.06,37.34 v4.32,37.59 5.08,37.59 | 5.08,37.59 5.5,37.59 U10.40 5.21,37.72 5.08,37.59
  Bottom 0.203: J3.C2 11.68,31.24 10.41,32.51 10.41,36.32 8.38,38.35 5.08,38.35 v4.32,37.59
N$3  (via drill 0.2)
  Top 0.203: v8.89,36.83 8.89,37.59 7.75,38.73 5.54,38.73 | C10.1 D2.CATHODE 5.54,38.73 | 5.54,38.73 U10.39
  Bottom 0.203: v8.89,36.83 8.89,31.5 11.68,28.7 J3.C7
N$4  (via drill 0.2)
  Top 0.203: v9.65,36.32 9.65,37.59 7.33,39.92 U10.38 5.58,39.88 4.83,39.88 3.18,41.53 C9.1 D4.CATHODE
  Bottom 0.203: v9.65,36.32 9.65,32 11.68,29.97 J3.C3
N$5
  Top 0.203: U9.12 26.85,26.8 R17.1
N$6
  Top 0.335: C8.1 U10.56
N$7
  Top 0.335: R3.2 15.56,17.21 arc90 J13.SIG
N$8
  Top 0.203: R11.1 LED1.A
N$9  (via drill 0.2)
  Top 0.203: v31.88,31.7 31.9,31.68 U6.53 | R21.2 37.85,50.29 | 37.85,50.29 38.77,50.29 U5.17 | v37.85,51.05 37.85,50.29
  Route15 0.203: v31.88,31.7 31.88,30.86 33.53,29.21 37.39,29.21 38.61,30.43 38.61,31.88 38.23,32.26 38.23,41.53 38.74,42.04 38.74,48.01 38.99,48.26 38.99,49.91 v37.85,51.05
N$10  (via drill 0.2)
  Top 0.203: U10.12 20.74,35.52 v20.83,35.43 | v22.61,28.07 22.73,28.19 24.38,28.19 24.62,27.96 U9.4
  Bottom 0.203: v20.83,35.43 21.34,34.93 21.34,34.04 20.83,33.53 20.83,29.21 21.97,28.07 v22.61,28.07
N$11  (via drill 0.2)
  Top 0.203: U10.13 20.66,36.62 v20.83,36.45 | v23.5,27.43 23.58,27.47 U9.5
  Route2 0.203: v20.83,36.45 21.34,35.94 21.34,29.72 21.84,29.21 22.61,29.21 23.5,28.32 v23.5,27.43
N$12
  Top 0.203: R31.2 37.08,51.94 37.22,51.8 U5.14
N$13  (via drill 0.2)
  Top 0.203: v20.32,20.83 21,20.15 Q1.3 | v22.22,12.95 LED1.C
  Bottom 0.203: v20.32,20.83 22.22,18.92 v22.22,12.95
N$14
  Top 0.203: U10.18 20.4,42.12 20.7,42.42 20.7,45.99 Q3.3
N$15  (via drill 0.2)
  Top 0.203: U10.2 21.15,24.52 C38.P$1 v21.84,25.65 | R33.2 23.27,41.15 v23.42,41.3
  Bottom 0.203: v21.84,25.65 20.45,25.65 19.81,26.29 19.81,40.64 21.08,41.91 22.96,41.91 23.42,41.45 v23.42,41.3
N$16
  Top 0.203: 19.57,38.86 U10.15 20.53,38.82 20.7,38.99 20.7,40.44 21.41,41.15 R33.1 21.82,41.31 Q2.3
N$17
  Top 0.203: R13.1 32.45,30.29 32.96,30.8 34.15,30.8 34.93,31.57 34.93,32.41 U6.59
N$18
  Top 0.203: LED4.3 32,28.45 32.35,28.8 32.35,29.06 R13.2
N$19
  Top 0.203: U6.7 42.5,36.21 L5.P$2
N$20
  Top 0.203: LED4.4 32.84,28.65 33.27,29.08 33.35,29.17 R14.2
N$21
  Top 0.203: R15.2 31.11,28.87 31.11,27.69 31.33,27.47 LED4.2
N$22  (via drill 0.2)
  Top 0.203: U10.11 v20.83,34.42 | v22.22,28.57 22.25,28.55 24.53,28.55 24.97,28.11 24.97,27.49 U9.3
  Route2 0.203: v20.83,34.42 20.83,29.21 21.46,28.57 v22.22,28.57
N$23
  Top 0.203: U10.10 19.57,33.27 20.57,33.27 20.83,33.02 20.83,29.84 21.46,29.21 24.51,29.21 25.42,28.3 U9.2
N$24
  Top 0.335: J12.SIG J2.1
N$25
  Top 0.203: R14.1 34.13,30.14 35.43,31.45 35.43,32.4 U6.60
N$26
  Top 0.203: R15.1 31.4,30.25 31.93,30.89 32.51,30.89 32.91,31.28 U6.55
N$27
  Top 0.203: LED2.A R12.1
N$28
  Top 0.203: R8.1 19.24,2.29 Q6.1
N$29
  Top 0.335: C8.2 9.27,18.35 arc90 10.41,17.21 R3.1 arc90 R2.1
N$30
  Top 0.335: R2.2 11.05,13.21 arc90 13.21,11.05 J1.1
N$31
  Top 0.254: Q4.1 3.24,29.16 R9.1
N$32
  Top 0.203: R7.1 54.54,47.17 55.12,47.75 56.72,47.75 Q5.1
N$33
  Top 0.203: U6.25 33.48,41.55 C22.1 FB1.1
N$34
  Top 0.254: U7.9 C17.2
N$36
  Top 0.203: U7.4 54.85,50.94 55.12,50.67 55.55,50.67 R36.1
N$37
  Top 0.254: U7.5 56.73,52.72 R44.1 R43.2
N$38
  Top 0.254: C18.2 21.34,51.05 21.46,51.18 21.46,53.19 U8.9
N$40
  Top 0.203: R37.1 18.29,52.32 18.64,52.67 U8.4
N$41
  Top 0.203: R42.2 16.31,50.62 16.64,50.29 18.29,50.29 18.47,50.47 R45.1 18.54,51.05 19.3,51.82 19.3,52.53 U8.5
N$52
  Top 0.203: U6.5 39.23,35.21 39.35,35.09 39.53,35.09 C26.1 39.88,34.67 40.77,33.78 42.1,33.78 | 42.1,33.78 42.48,33.78 L5.P$1 | C32.1 42.24,33.64 42.1,33.78
N$53
  Top 0.203: U6.36 28.61,39.21 28.57,39.12 28.57,38.73 29.1,38.73 U6.37
N$54
  Top 0.203: U6.34 28.75,40.21 28.7,40.26 28.7,40.64 28.77,40.71 U6.33
N$57
  Top 0.203: U4.31 62.11,37.41 B1.ANT1
N$58
  Top 0.203: U4.32 62.11,37.81 B1.ANT2
N$59
  Top 0.203: 63.57,37.61 64.04,37.61
  Top 0.254: B1.SE 63.57,37.61
  Top 0.762: 64.04,37.61 C1.1 | 66.19,37.61 A1.1
  Top 1.27: 64.04,37.61 66.19,37.61
N$60
  Top 0.203: L1.2 51.89,36.7 L4.1
N$61
  Top 0.203: U4.37 60.4,40.57 60.61,40.78 62.14,40.78 62.52,41.16 62.52,41.88 X4.1 62.52,41.87 C4.1
N$62
  Top 0.203: U4.38 60,40.68 60.23,40.91 60.23,43.19 C5.1 60.86,43.24 X4.3
N$63
  Top 0.203: C15.1 59.6,41.32 59.6,40.81 U4.39
N$64
  Top 0.203: U4.29 61.64,36.61 62.16,36.08 C20.1
N$65
  Top 0.203: LED3.A R16.2
N$66
  Top 0.203: S1.2 56.39,29.97 R10.2
NRF_A2
  Top 0.203: C7.1 56.17,43.21 X5.B | X5.B 56.8,43.29 U4.46 | 56.61,43.4 X5.B
NRF_A3
  Top 0.203: U4.45 57.2,43.02 X5.A 58.2,43.11 C6.1
NRF_BOOT  (via drill 0.2)
  Top 0.203: U6.45 29.09,34.67 27.81,34.67 27.28,34.14 27.28,28.22 29.97,25.53 44.32,25.53 45.47,26.67 45.47,37.15 J4.7 | v52.07,31.18 52.1,31.2 56.28,31.2 58.31,33.23 58.31,33.31 58.36,33.35 58.36,34.16 U4.19
  Route2 0.203: J4.7 47.69,37.21 50.1,37.21 50.91,36.4 50.91,32.54 52.07,31.38 v52.07,31.18
NRF_INT1/CTS  (via drill 0.2)
  Top 0.203: U6.27 32.41,42.88 v32.26,42.99 | v52.22,33.06 52.2,33.03 52.2,32.94 55.94,32.94 56.76,33.76 56.76,34.16 U4.15
  Route2 0.203: v32.26,42.99 32.26,43.12 32.89,43.75 45.09,43.75 45.83,44.48 46.67,44.48 | J4.3 46.61,44.41 46.67,44.48 | 46.67,44.48 51.41,44.48 52.22,43.66 v52.22,33.06
NRF_INT2/RTS  (via drill 0.2)
  Top 0.203: U6.28 31.9,42.52 v31.62,42.8 | v53.47,32.45 55.93,32.45 56.03,32.54 57.16,33.66 57.16,34.16 U4.16
  Route2 0.203: v31.62,42.8 31.62,43.31 32.45,44.13 44.77,44.13 45.47,44.83 49.21,44.83 | 49.21,44.83 49.15,44.89 J4.2 | 49.21,44.83 51.56,44.83 52.58,43.81 52.58,33.47 53.47,32.64 v53.47,32.45
NRF_P29
  Top 0.203: LED3.C 54.66,43.82 54.77,43.7 54.77,42.94 55.15,42.56 55.15,41.05 U4.48
NRF_POWER_GATE  (via drill 0.2)
  Top 0.203: v28.96,32.38 29.13,32.56 U6.48 | v53.21,46.36 53.27,46.3 R7.2 R40.2
  Route15 0.203: v40.36,38.61 41.21,39.46 41.21,44.13 44.26,47.18 46.48,47.18 | 46.48,47.18 52.39,47.18 v53.21,46.36 | J4.1 46.61,47.05 46.48,47.18
  Bottom 0.203: v28.96,32.38 29.21,32.64 35.94,32.64 37.59,34.29 37.59,37.21 38.6,38.21 39.97,38.21 v40.36,38.61
NRF_RX  (via drill 0.2)
  Top 0.203: v28.19,33.4 28.5,33.71 U6.47 | v52.64,32.38 53.04,31.99 55.98,31.99 56.09,32.09 56.28,32.28 56.38,32.37 56.38,32.38 57.55,33.56 57.55,34.16 U4.17
  Route2 0.203: J4.4 51.87,40.65 51.87,33.52 51.62,33.27 51.62,32.83 52.07,32.38 v52.64,32.38
  Route15 0.203: v28.19,33.4 27.69,32.77 27.69,28.32 29.97,26.04 44.2,26.04 45.09,26.92 45.09,41.91 v44.83,42.16
  Bottom 0.203: v44.83,42.16 47.94,42.16 J4.4
NRF_SWDCLK
  Top 0.203: J11.4 60.4,29.64 R32.1 60.4,33.63 U4.24
NRF_SWDIO/!RESET  (via drill 0.2)
  Top 0.203: U6.13 38.85,39.21 v39.64,39.99 | R10.1 59.84,30.53 59.87,30.75 | J11.2 59.87,29.63 59.87,30.75 | 59.87,30.75 59.87,31.62 | 59.87,31.62 v57.91,31.62 | 59.87,31.62 59.87,33.47 60,33.6 U4.23
  Route2 0.203: v39.64,39.99 40.41,40.77 46.55,40.77 J4.5 46.61,40.77 45.34,39.5 45.34,37.47 46.1,36.7 49.66,36.7 50.42,35.94 50.42,32 51.82,30.61 56.77,30.61 57.79,31.62 v57.91,31.62
NRF_TX  (via drill 0.2)
  Top 0.203: U6.46 28.11,34.21 27.69,33.78 27.69,28.32 29.97,26.04 44.2,26.04 45.09,26.92 45.09,38.61 45.97,39.5 47.82,39.5 J4.6 | v52.32,31.88 52.64,31.56 56.13,31.56 57.96,33.38 57.96,34.16 U4.18
  Route2 0.203: J4.6 50.42,40.83 51.51,39.74 51.51,33.66 51.27,33.42 51.27,32.68 51.92,32.03 52.17,32.03 v52.32,31.88
NRF_VCC  (via drill 0.2)
  Top 0.203: 52.58,40.89 53.59,39.88 53.59,39.46 C31.1 | v53.25,34.31 53.33,34.38 C29.1 55.07,34.88 55.07,35.01 U4.12 55.09,35.01 | C31.1 53.75,39.41 | C31.1 54.07,39.45 v54.39,39.77 | v54.39,39.77 54.57,39.95 R16.1 | v54.39,39.77 54.75,39.41 U4.1 | v57.57,26.37 58.63,26.37 59.05,26.8 59.09,27.51 59.12,27.47 J11.1
  Top 0.381: 52.58,40.89 52.58,44.45 52.83,44.7 58.67,44.7 59.49,45.52 59.52,45.52 Q5.3
  Bottom 0.203: v54.39,39.77 54.39,35.45 v53.25,34.31 53.25,33.75 56.9,30.1 56.9,27.04 v57.57,26.37
NUCLEUM_3V3
  Top 0.203: U1.6 48.76,49.78 48.9,49.91 48.9,50.42 49.02,50.55 49.46,50.55 R6.1
  Top 0.508: R6.1 49.66,50.49 49.66,47.3 51.44,45.47 56.39,45.47 57.42,46.5 Q5.2 57.18,46.3
NUCLEUM_GAUGE_ALERT
  Top 0.203: U5.4 43.55,50.3 43.69,50.16 43.69,48.39 44.39,47.69 | R22.1 43.82,45.97 44.39,46.55 44.39,47.69 | 44.39,47.69 46.66,47.69 47.08,47.27 48.48,47.27 49.09,47.88 49.09,49.09 48.9,49.28 U1.5
NUCLEUM_GAUGE_SCL
  Top 0.152: 45.67,51.18 R23.1
  Top 0.203: U5.6 43.06,51.3 43.31,51.05 44.45,51.05 44.45,49.78 | 44.45,49.78 44.45,48.9 44.57,48.78 U1.3 | 44.45,49.78 44.45,51.05 44.58,51.18 45.67,51.18
NUCLEUM_GAUGE_SDA  (via drill 0.2)
  Top 0.203: U5.5 42.67,50.8 42.8,50.67 43.94,50.68 44.07,50.55 44.07,48.64 44.45,48.26 48.29,48.26 | R24.1 43.36,47.61 43.37,47.62 v43.37,47.69 | 48.29,48.26 U1.4 | v48.32,47.88 48.32,48.22 48.29,48.26
  Bottom 0.203: v43.37,47.69 46.66,47.69 47.08,47.27 47.71,47.27 v48.32,47.88
PPS  (via drill 0.2)
  Top 0.203: U6.30 30.91,42.48 30.99,42.56 v30.99,43.05
  Route2 0.203: J8.7 34.06,62.23 34.29,62.23 35.43,61.09 35.43,55.12 34.93,54.61 v34.93,54.48
  Route15 0.203: v30.99,43.05 30.61,43.43 30.61,43.94 31.11,44.45 32.13,44.45 35.43,47.75 35.43,53.98 v34.93,54.48
RADIO_SWDCLK  (via drill 0.2)
  Top 0.203: v28.32,50.67 28.45,50.67 J10.4 | v29.08,45.29 29.34,45.54 R35.1 | U6.9 v39.73,37.21
  Route2 0.203: v29.08,45.29 29.69,44.68 v39.27,44.68
  Route15 0.203: v39.73,37.21 40.01,36.93 40.01,28.25 v39.9,28.09
  Bottom 0.203: v28.32,50.67 29.08,50.04 v29.08,45.29 | J7.21 37.85,2.79 39.12,4.06 39.12,13.34 40.96,15.24 40.96,26.73 39.9,27.79 v39.9,28.09 | v39.73,37.21 40.39,37.21 41.53,38.35 41.53,42.42 v39.27,44.68
RADIO_SWDIO  (via drill 0.2)
  Top 0.203: v28.3,45.31 28.07,45.85 R34.1 28.02,46.1 27.43,46.1 27.18,46.36 27.18,47.19 27.37,47.38 28.21,47.38 29.08,48.26 29.08,49.91 29.34,50.16 J10.2 | U6.10 38.19,37.72 v39.4,37.72
  Route2 0.203: v28.3,45.31 28.96,45.97 v37.34,45.97 | v40.62,28.09 40.62,27.84 40.96,27.5 40.96,16.26 v38.48,13.72
  Route15 0.203: v39.4,37.72 39.88,37.72 40.39,37.21 40.39,29.21 40.62,28.98 v40.62,28.09
  Bottom 0.203: v37.34,45.97 37.34,45.72 41.09,41.97 41.09,38.59 40.21,37.72 v39.4,37.72 | J7.22 37.85,7.37 38.1,7.62 38.1,13.34 v38.48,13.72
RADIO_XIN
  Top 0.203: 38.18,29.47 C2.1 | 38.18,29.47 39.32,29.47 X1.3 | U6.1 38.18,29.47
RADIO_XOUT
  Top 0.203: U6.2 38.94,33.71 41.57,31.08 X1.1 43.14,30.62 C3.1
SCL  (via drill 0.2)
  Top 0.203: U6.12 39.09,38.71 v39.62,39.24
  Bottom 0.203: J8.5 36.55,62.21 35.43,61.09 35.43,59.05 36.2,58.29 36.2,45.72 40.13,41.78 40.13,39.75 v39.62,39.24
SCL_INTERNAL  (via drill 0.2)
  Top 0.203: v34.39,31.7 34.41,31.81 U6.58 | R20.2 37.26,49.33 37.72,49.78 v37.91,49.78 38.76,49.78 U5.18
  Route15 0.203: v34.39,31.7 34.29,31.57 35.64,30.23 37.21,30.23 37.72,30.73 37.72,31.75 37.47,32 37.47,42.04 37.97,42.55 37.97,49.59 37.85,49.72 v37.91,49.78
SDA  (via drill 0.2)
  Top 0.203: U6.11 39.3,38.21 v40.51,39.42
  Bottom 0.203: J8.6 36.58,45.97 40.51,42.04 v40.51,39.42
SDA_INTERNAL  (via drill 0.2)
  Top 0.203: v33.88,31.32 33.88,32.08 33.91,32.13 U6.57 | R19.2 38.23,47.62 38.23,48.26 v38.48,48.51 38.78,48.82 U5.19
  Route15 0.203: v33.88,31.32 33.88,30.23 34.52,29.59 37.14,29.59 38.18,30.63 38.18,31.8 37.85,32.13 37.85,41.78 38.35,42.29 38.35,48.39 v38.48,48.51
USB_D+  (via drill 0.2)
  Top 0.203: U6.63 36.91,31.55 37.21,31.24 v37.21,30.99
  Route15 0.203: J8.11 30.07,61.09 30.1,61.09 30.1,58.55 24.77,53.21 24.77,48.01 29.46,43.31 29.46,39.75 29.72,39.5 29.72,33.91 30.48,33.15 35.81,33.15 37.21,31.75 v37.21,30.99
USB_D-  (via drill 0.2)
  Top 0.203: v36.58,31.12 36.41,31.29 U6.62
  Route15 0.203: J8.12 28.96,58.55 24,53.59 24,48.01 28.96,43.05 28.96,33.78 29.97,32.77 35.56,32.77 36.58,31.75 v36.58,31.12
V_GSM_INT  (via drill 0.2)
  Top 0.203: U10.4 21,26.72 v21.21,26.92 | U9.1 25.93,27.56 v25.93,28.57
  Bottom 0.203: v21.21,26.92 24.13,26.92 24.64,27.43 25.81,27.43 25.93,27.56 v25.93,28.57
VDD_PA1
  Top 0.203: U4.30 61.85,37.01 62.31,36.55 C16.1 62.76,37.35 B1.VCC
XDOT_3V3  (via drill 0.61, 1.02)
  Top 0.152: 48.01,52.5 R5.1
  Top 0.203: U2.6 45.31,53.75 45.47,53.59 47.88,53.59 48.01,53.47 48.01,52.5
  Top 0.61: R5.1 v46.86,52.58
  Route15 1.016: 47.12,52.45 v46.86,52.58
  Route15 1.778: v22.73,3.43 24.38,5.08 24.38,8.76 27.43,11.81 43.31,11.81 49.28,17.65 57.66,17.65 65.79,25.78 65.79,31.12 62.8,34.1 62.8,44.01 59.18,47.62 53.59,47.62 48.77,52.45 47.12,52.45
  pour Top (isolate 0.305): 20.7,2.92 20.7,5.08 23.88,5.08 23.88,2.16 20.7,2.16
XDOT_CTS  (via drill 0.2)
  Top 0.203: v28.07,35.18 28.09,35.21 U6.44 | v31.88,21.21 U11.P$32
  Route2 0.203: v31.88,21.21 v31.88,24.51 | v44.96,24.51 44.96,26.8 45.47,27.3 45.47,31.81 J6.3
  Route15 0.203: v28.07,35.18 27.81,35.18 27.3,34.67 27.3,28.19 28.04,27.45 28.04,25.3 28.83,24.51 v31.88,24.51 v44.96,24.51
XDOT_DBG_UART_RX  (via drill 0.2)
  Top 0.203: v49.02,8.25 U11.P$16
  Bottom 0.203: v49.02,8.25 49.15,8.25 J6.10
XDOT_DBG_UART_TX  (via drill 0.2)
  Top 0.203: U11.P$15 v49.4,6.48
  Bottom 0.203: J6.8 49.72,27.88 50.29,27.3 50.29,24.38 49.66,23.75 49.66,6.73 v49.4,6.48
XDOT_GATED  (via drill 0.2, 0.51)
  Top 0.203: v52.71,20.57 53.98,20.57 J9.1
  Top 0.762: U11.P$3 30.1,2.41 | U11.P$4 31.88,2.41
  Route2 0.203: v22.73,6.6 22.73,9.78 23.88,11.18 42.67,11.18 v52.71,20.57
  other vias: 20.57,7.24 21.59,6.6 28.19,2.92 28.19,3.94 28.19,4.95 28.19,5.97
  pour Route2 (isolate 0.305): 29.08,2.41 29.08,7.87 19.81,7.87 19.81,5.59 24.89,5.59 24.89,2.41
  pour Top (isolate 0.305): 29.46,1.91 29.46,2.41 27.56,2.41 27.56,6.35 32.51,6.35 32.51,1.91
  pour Top (no thermals): 23.37,5.84 19.81,5.84 19.81,7.87 23.37,7.87
XDOT_GPIO0
  Top 0.203: U11.P$26 42.55,20.96 42.8,20.7 44.45,20.7 45.21,19.94 46.99,19.94 48.64,18.29 R12.2
XDOT_INT1  (via drill 0.2)
  Top 0.203: v32.39,31.45 32.39,32.41 U6.54 | v44.32,21.46 U11.P$25
  Route2 0.203: v44.32,21.46 44.32,23.11 45.47,24.26 45.47,26.73 J6.7
  Route15 0.203: v43.69,25.02 v31.5,25.02
  Bottom 0.203: v31.5,25.02 31.5,30.35 v32.39,31.45 | v43.69,25.02 44.07,25.02 44.32,24.77 v44.32,21.46
XDOT_POWER_GATE  (via drill 0.2)
  Top 0.203: v18.29,1.65 v18.29,1.66 20.12,1.66 | 20.12,1.66 R41.2 | R8.2 20.12,1.66 | U6.21 35.43,41.51 v35.43,42.36
  Route2 0.203: v22.99,11.94 42.04,11.94 43.18,13.08 43.18,22.99 44.32,24.13 44.32,26.92 44.96,27.56 44.96,33.85 J6.1 | v35.43,42.36 35.43,43.02 35.81,43.33 44.68,43.33 v44.83,43.18
  Route15 0.203: v18.29,1.65 18.29,7.24 v22.99,11.94 | v44.83,43.18 45.59,42.42 45.59,36.51 J6.1
XDOT_RTS  (via drill 0.2)
  Top 0.203: v33.38,31.65 33.41,31.63 U6.56 | v33.66,21.08 U11.P$31 33.66,23.5 34.16,24 49.66,24 50.55,24.89 50.55,34.1 J6.2
  Route2 0.203: v33.38,31.65 33.38,30.07 33.66,29.79 v33.66,21.08
XDOT_RX  (via drill 0.2)
  Top 0.203: v30.73,30.99 30.9,31.2 U6.51 | v30.48,18.03 42.23,18.03 43.75,16.51 43.69,5.84 44.83,4.7 U11.P$14 50.55,4.7 v50.67,4.83
  Route2 0.203: v30.48,18.03 29.59,18.8 29.59,29.91 v30.73,30.99
  Bottom 0.203: J6.4 51.03,31.08 51.03,24.12 50.55,23.63 50.55,4.83 v50.67,4.83
XDOT_SWCLK  (via drill 0.2)
  Top 0.203: v37.21,21.53 U11.P$29 | v51.18,23.11 52.15,24.08 55.37,24.08 55.88,23.57 J9.4
  Route15 0.203: v37.21,21.53 37.21,22.86 37.47,23.11 v51.18,23.11
XDOT_SWDIO  (via drill 0.2)
  Top 0.203: v35.43,21.46 U11.P$30 | v53.59,23.62 54.48,22.73 J9.2
  Route15 0.203: v35.43,21.46 35.43,23.37 35.69,23.62 51.56,23.62 v51.94,23.11
  Bottom 0.203: v51.94,23.11 52.45,23.62 v53.59,23.62
XDOT_TX  (via drill 0.2)
  Top 0.203: v30.23,31.37 30.4,31.55 U6.50 | v37.34,15.8 41.86,15.8 43.31,14.35 43.31,4.45 44.83,2.92 U11.P$13 v49.28,2.92
  Bottom 0.203: v30.23,31.37 29.59,30.73 29.59,17.72 31.5,15.81 v37.34,15.8 | J6.6 49.34,30.42 50.67,29.08 50.67,24.26 50.01,23.6 50.01,3.53 49.4,2.92 v49.28,2.92
XDOT_WAKE  (via drill 0.2)
  Top 0.203: U11.P$34 v28.32,21.46 | v29.46,31.5 29.9,31.94 U6.49
  Route15 0.203: v28.32,21.46 28.32,23.37 28.57,23.62 31.88,23.62 32.26,24 45.28,24 J6.9
  Bottom 0.203: v28.32,21.46 28.32,30.35 v29.46,31.5

## Text on the board
tPlace: VBUS | D+ | PPS | SCL | GND | GND | D- | IN | OUT | SDA | 3V3 | 5V | SAM4L PROG | C | CTS | GATE | RTS | TX | NRF | !RST | RX | GSM | GATE | RTS | BOOT | CTS | RX | CTS | RST | TX | RTS | POWER | GND | INT | NRF / PROG | XDOT | XDOT / PROG | 3G / Antennas | -UFL | XDOT (LoRa) / Antennas | -SMA
bPlace: GPIO1 | !RESET | SWDIO | RX | GND | TX | GPIO2 | SWDCLK
tNames: GND | 5V | 3V8 | 3V3 | Radio Module | 09/2017 | Joshua Adkins | GND | GATE | TX | !RST | RX | DBG / TX | NRF RESET | WAKE | DBG / RX
Measures: 0.358 / 9.10 Below PCB | 0.1 / 2.54 Above PCB
Reference: Drill 0.116 @ (-0.825, 1.15) | Drill 0.116 @ (0.825, 1.15) | GND | GND | Drill 0.116 @ (-0.825, -1.15) | Drill 0.116 @ (0.825, -1.15) | GND | GND